# EAGLE design STM32F103_PCB (EAGLE 6.1)
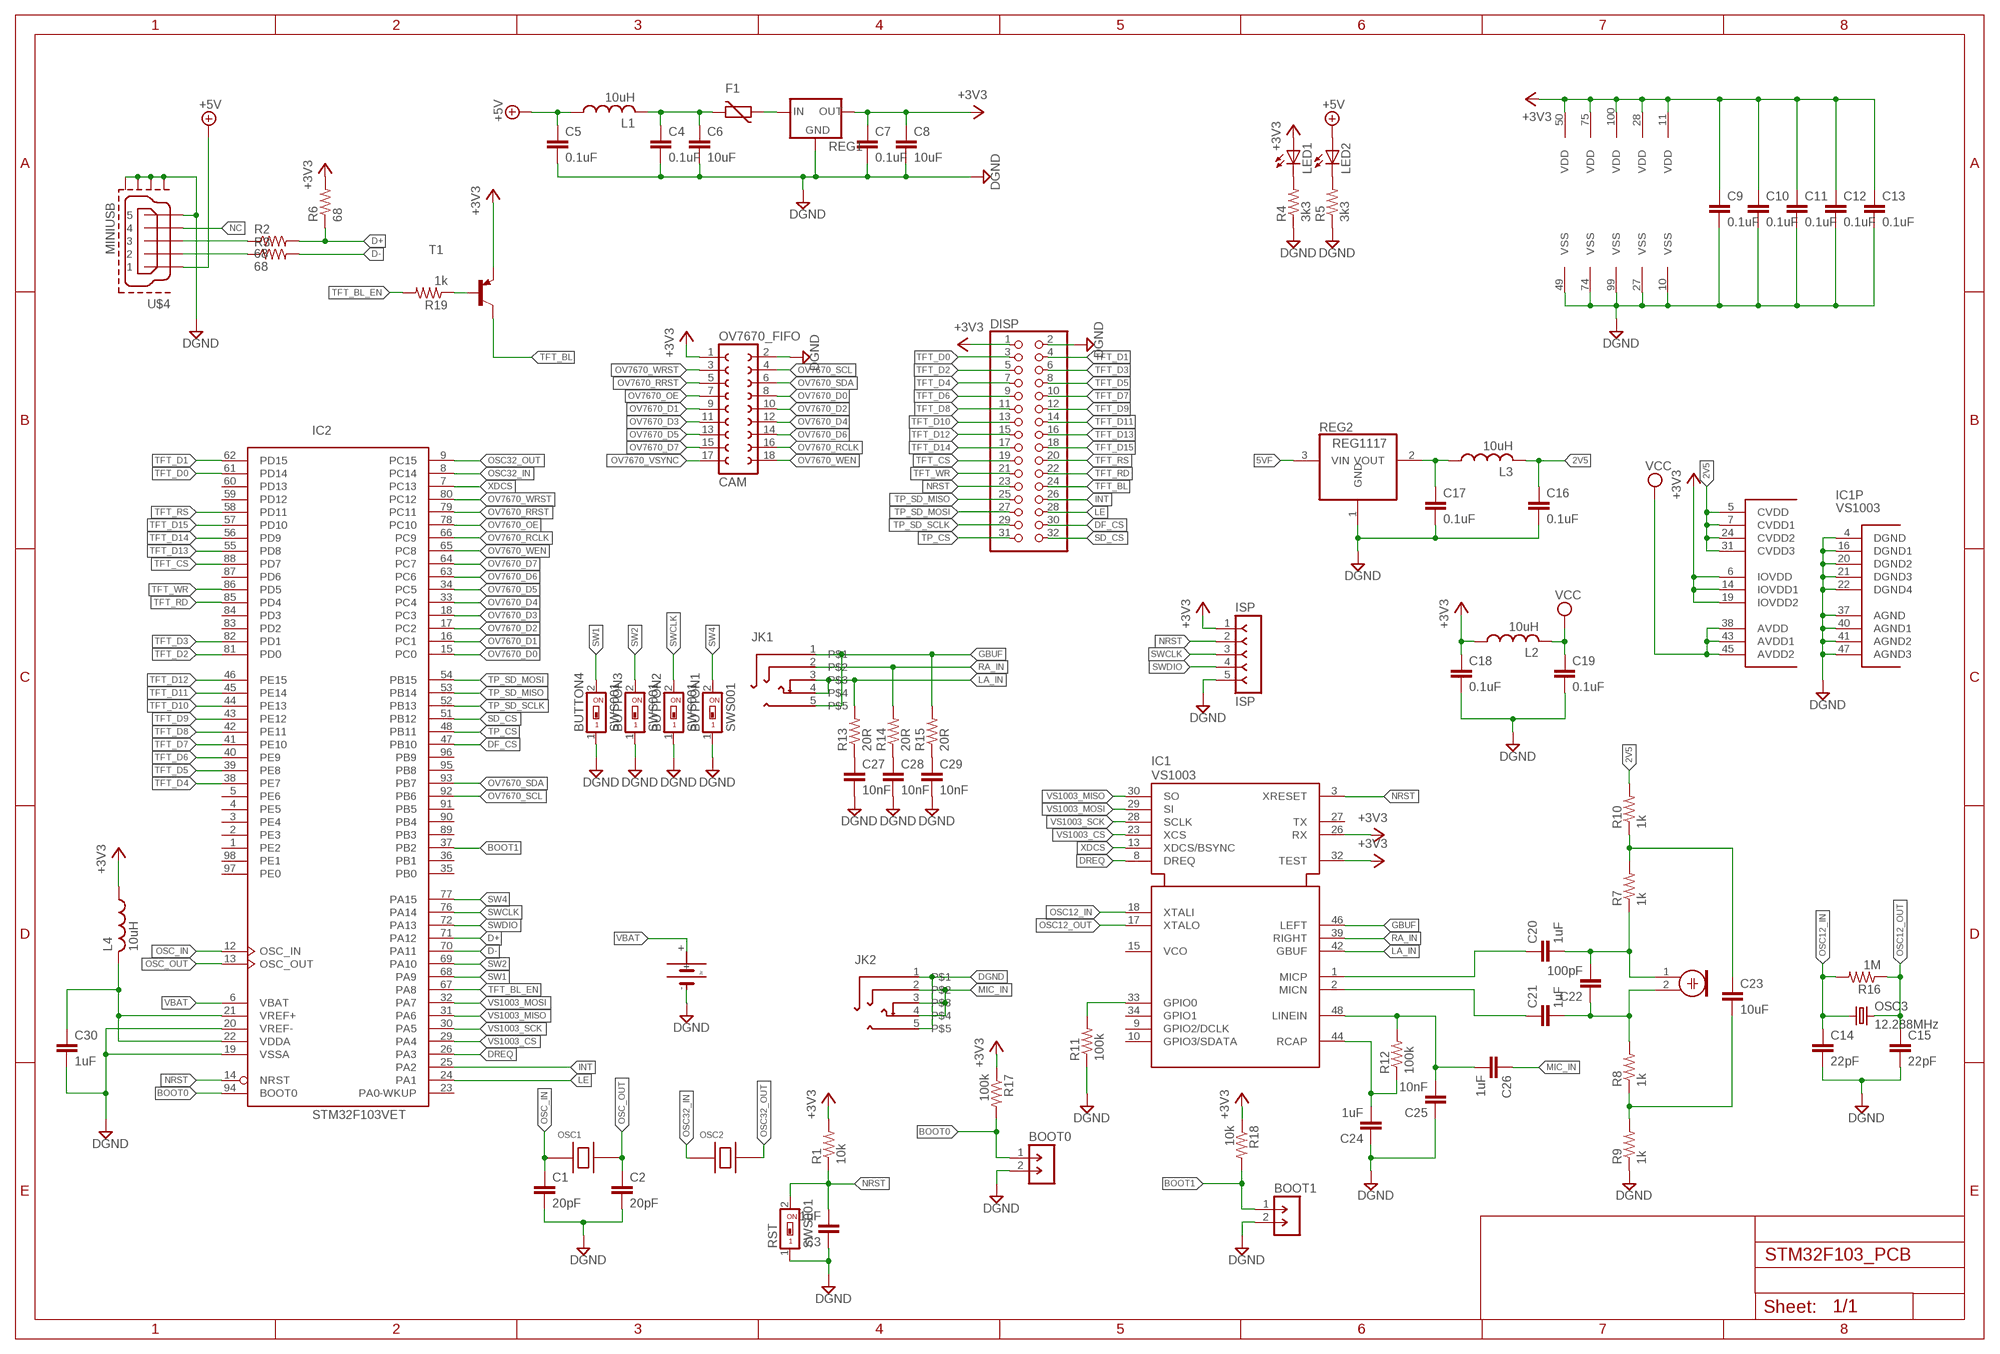
[diagram p0: schematic, sheet 1]

## Parts
BOOT0  M-1X02-SIP-100-32  [SIP-100-02-32]
BOOT1  M-1X02-SIP-100-32  [SIP-100-02-32]
BUTTON1  SWS001  [SMS-001]
BUTTON2  SWS001  [SMS-001]
BUTTON3  SWS001  [SMS-001]
BUTTON4  SWS001  [SMS-001]
C1  20pF  C-EUC1206  [C1206]
C2  20pF  C-EUC1206  [C1206]
C3  1uF  C-EUC1206  [C1206]
C4  0.1uF  C-EUC1206  [C1206]
C5  0.1uF  C-EUC1206  [C1206]
C6  10uF  C-EUC1206  [C1206]
C7  0.1uF  C-EUC1206  [C1206]
C8  10uF  C-EUC1206  [C1206]
C9  0.1uF  C-EUC1206  [C1206]
C10  0.1uF  C-EUC1206  [C1206]
C11  0.1uF  C-EUC1206  [C1206]
C12  0.1uF  C-EUC1206  [C1206]
C13  0.1uF  C-EUC1206  [C1206]
C14  22pF  C-EUC1206  [C1206]
C15  22pF  C-EUC1206  [C1206]
C16  0.1uF  C-EUC1206  [C1206]
C17  0.1uF  C-EUC1206  [C1206]
C18  0.1uF  C-EUC1206  [C1206]
C19  0.1uF  C-EUC1206  [C1206]
C20  1uF  C-EUC1206  [C1206]
C21  1uF  C-EUC1206  [C1206]
C22  100pF  C-EUC1206  [C1206]
C23  10uF  C-EUC1206  [C1206]
C24  1uF  C-EUC1206  [C1206]
C25  10nF  C-EUC1206  [C1206]
C26  1uF  C-EUC1206  [C1206]
C27  10nF  C-EUC1206  [C1206]
C28  10nF  C-EUC1206  [C1206]
C29  10nF  C-EUC1206  [C1206]
C30  1uF  C-EUC1206  [C1206]
CAM  OV7670_FIFO  FE09-2  [FE09-2]
DISP  PINHD-2X16  [2X16]
F1  VARISTORCN1206  [CT/CN1206]
IC1  VS1003  [LQFP48]
IC2  STM32F103VET  [LQFP100]
ISP  ISP  F-1X05-SIP-100-40  [SIP-100-05-40]
JK1  HEADPHONE_XXX1  [HEADPHONE_XXX1]
JK2  HEADPHONE_XXX1  [HEADPHONE_XXX1]
L1  10uH  L-USL3216C  [L3216C]
L2  10uH  L-USL3216C  [L3216C]
L3  10uH  L-USL3216C  [L3216C]
L4  10uH  L-USL3216C  [L3216C]
LED1  LEDSML1206  [SML1206]
LED2  LEDSML1206  [SML1206]
MIC  ELECTRET_MICROPHON-WM-61A  [WM-61A]
OSC1  8.0MHz  SMCE-7050  [IQG7050B]
OSC2  32.768kHz  SMAQ-5032A  [IQG5032A]
OSC3  12.288MHz  CRYSTALHC49UP  [HC49UP]
R1  10k  R-US_R1206  [R1206]
R2  68  R-US_R1206  [R1206]
R3  68  R-US_R1206  [R1206]
R4  3k3  R-US_R1206  [R1206]
R5  3k3  R-US_R1206  [R1206]
R6  68  R-US_R1206  [R1206]
R7  1k  R-US_R1206  [R1206]
R8  1k  R-US_R1206  [R1206]
R9  1k  R-US_R1206  [R1206]
R10  1k  R-US_R1206  [R1206]
R11  100k  R-US_R1206  [R1206]
R12  100k  R-US_R1206  [R1206]
R13  20R  R-US_R1206  [R1206]
R14  20R  R-US_R1206  [R1206]
R15  20R  R-US_R1206  [R1206]
R16  1M  R-US_R1206  [R1206]
R17  100k  R-US_R1206  [R1206]
R18  10k  R-US_R1206  [R1206]
R19  1k  R-US_R1206  [R1206]
REG1  XC63FPM  [SOT23]
REG2  REG1117  [SOT223]
RST  SWS001  [SMS-001]
T1  MMBT3906LT1-PNP-SOT23-BEC  [SOT23-BEC]
U$1  1220BATTERY_SF  [1220BATTERY]
U$4  MINIUSB  [MK5P]

## Nets
2V5: C16.1 IC1.5(CVDD) IC1.7(CVDD1) IC1.24(CVDD2) IC1.31(CVDD3) L3.2 R10.2
5VF: F1.1 REG1.3(IN) REG2.3(VIN)
+3V3: C7.1 C8.1 C9.1 C10.1 C11.1 C12.1 C13.1 C18.1 CAM.1 DISP.1 IC1.6(IOVDD) IC1.14(IOVDD1) IC1.19(IOVDD2) IC1.26(RX) IC1.32(TEST) IC2.11(VDD) IC2.28(VDD) IC2.50(VDD) IC2.75(VDD) IC2.100(VDD) ISP.1 L2.1 L4.1 LED1.A R1.2 R6.2 R17.1 R18.1 REG1.2(OUT) T1.E
+5V: C5.1 L1.1 LED2.A U$4.1
BOOT0: BOOT0.1 IC2.94(BOOT0) R17.2
BOOT1: BOOT1.1 IC2.37(PB2) R18.2
D+: IC2.71(PA12) R2.2 R6.1
D-: IC2.70(PA11) R3.2
DF_CS: DISP.30 IC2.47(PB10)
DGND: BOOT0.2 BOOT1.2 BUTTON1.1 BUTTON2.1 BUTTON3.1 BUTTON4.1 C1.2 C2.2 C3.1 C4.2 C5.2 C6.2 C7.2 C8.2 C9.2 C10.2 C11.2 C12.2 C13.2 C14.2 C15.2 C16.2 C17.2 C18.2 C19.2 C24.1 C25.1 C27.2 C28.2 C29.2 C30.2 CAM.2 DISP.2 IC1.4(DGND) IC1.16(DGND1) IC1.20(DGND2) IC1.21(DGND3) IC1.22(DGND4) IC1.37(AGND) IC1.40(AGND1) IC1.41(AGND2) IC1.47(AGND3) IC2.10(VSS) IC2.19(VSSA) IC2.20(VREF-) IC2.27(VSS) IC2.49(VSS) IC2.74(VSS) IC2.99(VSS) ISP.5 JK2.1 JK2.5 R4.1 R5.1 R9.1 R11.1 REG1.1(GND) REG2.1(GND) RST.1 U$1.- U$4.5 U$4.P$1(GND1) U$4.P$2(GND2) U$4.P$6(GND3) U$4.P$7(GND4)
DREQ: IC1.8(DREQ) IC2.26(PA3)
GBUF: IC1.46(LEFT) JK1.1 JK1.5 R15.2
INT: DISP.26 IC2.25(PA2)
LA_IN: IC1.42(GBUF) JK1.3 JK1.4 R13.2
LE: DISP.28 IC2.24(PA1)
MIC_IN: C26.1 JK2.2 JK2.3 JK2.4
N$1: C17.1 L3.1 REG2.2(VOUT)
N$2: R3.1 U$4.2
N$3: R2.1 U$4.3
N$4: C4.1 C6.1 F1.2 L1.2
N$5: LED1.C R4.2
N$6: LED2.C R5.2
N$7: C20.1 IC1.1(MICP)
N$8: C21.1 IC1.2(MICN)
N$9: C21.2 C22.1 MIC.2 R8.2
N$10: C20.2 C22.2 MIC.1 R7.1
N$11: C23.1 R7.2 R10.1
N$12: C23.2 R8.1 R9.2
N$13: IC1.33(GPIO0) R11.2
N$14: C24.2 IC1.44(RCAP) R12.1
N$15: C25.2 C26.2 IC1.48(LINEIN) R12.2
N$16: C27.1 R13.1
N$17: R19.1 T1.B
N$19: C28.1 R14.1
N$20: C29.1 R15.1
N$24: C30.1 IC2.21(VREF+) IC2.22(VDDA) L4.2
NC: U$4.4
NRST: C3.2 DISP.23 IC1.3(XRESET) IC2.14(NRST) ISP.2 R1.1 RST.2
OSC12_IN: C14.1 IC1.18(XTALI) OSC3.1 R16.2
OSC12_OUT: C15.1 IC1.17(XTALO) OSC3.2 R16.1
OSC32_IN: IC2.8(PC14) OSC2.P$1(PIN1)
OSC32_OUT: IC2.9(PC15) OSC2.P$2(PIN2)
OSC_IN: C1.1 IC2.12(OSC_IN) OSC1.P$1(PIN1)
OSC_OUT: C2.1 IC2.13(OSC_OUT) OSC1.P$3(PIN2)
OV7670_D0: CAM.8 IC2.15(PC0)
OV7670_D1: CAM.9 IC2.16(PC1)
OV7670_D2: CAM.10 IC2.17(PC2)
OV7670_D3: CAM.11 IC2.18(PC3)
OV7670_D4: CAM.12 IC2.33(PC4)
OV7670_D5: CAM.13 IC2.34(PC5)
OV7670_D6: CAM.14 IC2.63(PC6)
OV7670_D7: CAM.15 IC2.64(PC7)
OV7670_OE: CAM.7 IC2.78(PC10)
OV7670_RCLK: CAM.16 IC2.66(PC9)
OV7670_RRST: CAM.5 IC2.79(PC11)
OV7670_SCL: CAM.4 IC2.92(PB6)
OV7670_SDA: CAM.6 IC2.93(PB7)
OV7670_VSYNC: CAM.17
OV7670_WEN: CAM.18 IC2.65(PC8)
OV7670_WRST: CAM.3 IC2.80(PC12)
RA_IN: IC1.39(RIGHT) JK1.2 R14.2
SD_CS: DISP.32 IC2.51(PB12)
SW1: BUTTON4.2 IC2.68(PA9)
SW2: BUTTON3.2 IC2.69(PA10)
SW4: BUTTON1.2 IC2.77(PA15)
SWCLK: BUTTON2.2 IC2.76(PA14) ISP.3
SWDIO: IC2.72(PA13) ISP.4
TFT_BL: DISP.24 T1.C
TFT_BL_EN: IC2.67(PA8) R19.2
TFT_CS: DISP.19 IC2.88(PD7)
TFT_D0: DISP.3 IC2.61(PD14)
TFT_D1: DISP.4 IC2.62(PD15)
TFT_D2: DISP.5 IC2.81(PD0)
TFT_D3: DISP.6 IC2.82(PD1)
TFT_D4: DISP.7 IC2.38(PE7)
TFT_D5: DISP.8 IC2.39(PE8)
TFT_D6: DISP.9 IC2.40(PE9)
TFT_D7: DISP.10 IC2.41(PE10)
TFT_D8: DISP.11 IC2.42(PE11)
TFT_D9: DISP.12 IC2.43(PE12)
TFT_D10: DISP.13 IC2.44(PE13)
TFT_D11: DISP.14 IC2.45(PE14)
TFT_D12: DISP.15 IC2.46(PE15)
TFT_D13: DISP.16 IC2.55(PD8)
TFT_D14: DISP.17 IC2.56(PD9)
TFT_D15: DISP.18 IC2.57(PD10)
TFT_RD: DISP.22 IC2.85(PD4)
TFT_RS: DISP.20 IC2.58(PD11)
TFT_WR: DISP.21 IC2.86(PD5)
TP_CS: DISP.31 IC2.48(PB11)
TP_SD_MISO: DISP.25 IC2.53(PB14)
TP_SD_MOSI: DISP.27 IC2.54(PB15)
TP_SD_SCLK: DISP.29 IC2.52(PB13)
VBAT: IC2.6(VBAT) U$1.+
VCC: C19.1 IC1.38(AVDD) IC1.43(AVDD1) IC1.45(AVDD2) L2.2
VS1003_CS: IC1.23(XCS) IC2.29(PA4)
VS1003_MISO: IC1.30(SO) IC2.31(PA6)
VS1003_MOSI: IC1.29(SI) IC2.32(PA7)
VS1003_SCK: IC1.28(SCLK) IC2.30(PA5)
XDCS: IC1.13(XDCS/BSYNC) IC2.7(PC13)
Unconnected: IC1.9(GPIO2/DCLK) IC1.10(GPIO3/SDATA) IC1.15(VCO) IC1.27(TX) IC1.34(GPIO1) IC2.1(PE2) IC2.2(PE3) IC2.3(PE4) IC2.4(PE5) IC2.5(PE6) IC2.23(PA0-WKUP) IC2.35(PB0) IC2.36(PB1) IC2.59(PD12) IC2.60(PD13) IC2.83(PD2) IC2.84(PD3) IC2.87(PD6) IC2.89(PB3) IC2.90(PB4) IC2.91(PB5) IC2.95(PB8) IC2.96(PB9) IC2.97(PE0) IC2.98(PE1)

## Library data of the parts
BOOT0 BOOT1 = con-headers-jp:M-1X02-: MALE HEADER
BUTTON1-BUTTON4 RST = smd-special:SWS001: SMD Dip Switch 1 pol.
C1-C30 = resistor:C-EU: CAPACITOR, European symbol
CAM = con-lsta:FE09-2: FEMALE HEADER; OC_FARNELL: unknown; OC_NEWARK: unknown
DISP = pinhead:PINHD-2X16: PIN HEADER
F1 = varistor:VARISTOR: VARISTOR
IC1 = vlsi-web:VS1003: MP3 / WMA / MIDI Audio Codec Circuit
IC2 = micro-stm_v2:STM32F103V*T: ARM 32-bit Cortex™-M3 CPU 72 MHz maximum frequency 64 to 1028 Kbytes of Flash memory 20 to 96 kbytes of SRAM 80 GPIOs 2.0 to 3.6 V application supply
ISP = con-headers-jp:F-1X05-: FEMALE HEADER
JK1 JK2 = 2ref-packages-longpad:HEADPHONE_XXX1
L1-L4 = rcl:L-US: INDUCTOR, American symbol
LED1 LED2 = led:LED: LED OSRAM: - CHIPLED LG R971, LG N971, LY N971, LG Q971, LY Q971, LO R971, LY R971 LH N974, LH R974 LS Q976, LO Q976, LY Q976 LO Q996 - Hyper CHIPLED LW Q18S LB Q993, LB Q99A, LB R99A - SideLED LS A670, LO A670, LY A670, LG A670, LP A670 LB A673, LV A673, LT A673, LW A673 LH A674 LY A675 LS A676, LA A676, LO A676, LY A676, LW A676 LS A679, LY A679, LG A679 - Hyper Micro SIDELED® LS Y876, LA Y876, LO Y876, LY Y876 LT Y87S - SmartLED LW L88C, LW L88S LB L89C, LB L89S, LG L890 LS L89K, LO L89K, LY L89K LS L896, LA L896, LO L896, LY L896 - TOPLED LS T670, LO T670, LY T670, LG T670, LP T670 LSG T670, LSP T670, LSY T670, LOP T670, LYG T670 LG T671, LOG T671, LSG T671 LB T673, LV T673, LT T673, LW T673 LH T674 LS T676, LA T676, LO T676, LY T676, LB T676, LH T676, LSB T676, LW T676 LB T67C, LV T67C, LT T67C, LS T67K, LO T67K, LY T67K, LW E67C LS E67B, LA E67B, LO E67B, LY E67B, LB E67C, LV E67C, LT E67C LW T67C LS T679, LY T679, LG T679 LS T770, LO T770, LY T770, LG T770, LP T770 LB T773, LV T773, LT T773, LW T773 LH T774 LS E675, LA E675, LY E675, LS T675 LS T776, LA T776, LO T776, LY T776, LB T776 LHGB T686 LT T68C, LB T68C - Hyper Mini TOPLED® LB M676 - Mini TOPLED Santana® LG M470 LS M47K, LO M47K, LY M47K Source: http://www.osram.convergy.de LUXEON: - LUMILED® LXK2-PW12-R00, LXK2-PW12-S00, LXK2-PW14-U00, LXK2-PW14-V00 LXK2-PM12-R00, LXK2-PM12-S00, LXK2-PM14-U00 LXK2-PE12-Q00, LXK2-PE12-R00, LXK2-PE12-S00, LXK2-PE14-T00, LXK2-PE14-U00 LXK2-PB12-K00, LXK2-PB12-L00, LXK2-PB12-M00, LXK2-PB14-N00, LXK2-PB14-P00, LXK2-PB14-Q00 LXK2-PR12-L00, LXK2-PR12-M00, LXK2-PR14-Q00, LXK2-PR14-R00 LXK2-PD12-Q00, LXK2-PD12-R00, LXK2-PD12-S00 LXK2-PH12-R00, LXK2-PH12-S00 LXK2-PL12-P00, LXK2-PL12-Q00, LXK2-PL12-R00 Source: www.luxeon.com KINGBRIGHT: KA-3528ASYC Source: www.kingbright.com
MIC = microphon:ELECTRET_MICROPHON-: Electret Condenser Microphone
OSC1 = osc:SMCE-7050: Seam Welded Seal SMD Package SMCE-7050 4 Pads Pb-Free, RoHs Compliant Company Website:http://www.interquip.com/
OSC2 = osc:SMAQ-5032A: All Quartz SMD Package SMAQ-5032A 2Pads Pb-Free, RoHs Compliant Company Website:http://www.interquip.com/
OSC3 = crystal:CRYSTAL: CRYSTAL; OC_FARNELL: unknown; OC_NEWARK: unknown
R1-R19 = resistor:R-US_: RESISTOR, American symbol
REG1 = v-reg-3:XC63FP: Positiv Voltage Regulators www.torex.co.jp/english/product/pro02/pdf/0201_xc62fp.pdf
REG2 = burr-brown:REG1117: 800mA and 1A Low Dropout (LDO) Positive Regulator 1.8V, 2.5V, 2.85V, 3.3V, 5V, and Adj; MPN: REG1117; OC_FARNELL: 1097566; OC_NEWARK: 14P6981
T1 = transistor-neu-to92:*-PNP-: PNP Transistror
U$1 = battery2:1220BATTERY_SF
U$4 = usb_con-update:MINIUSB

## Board
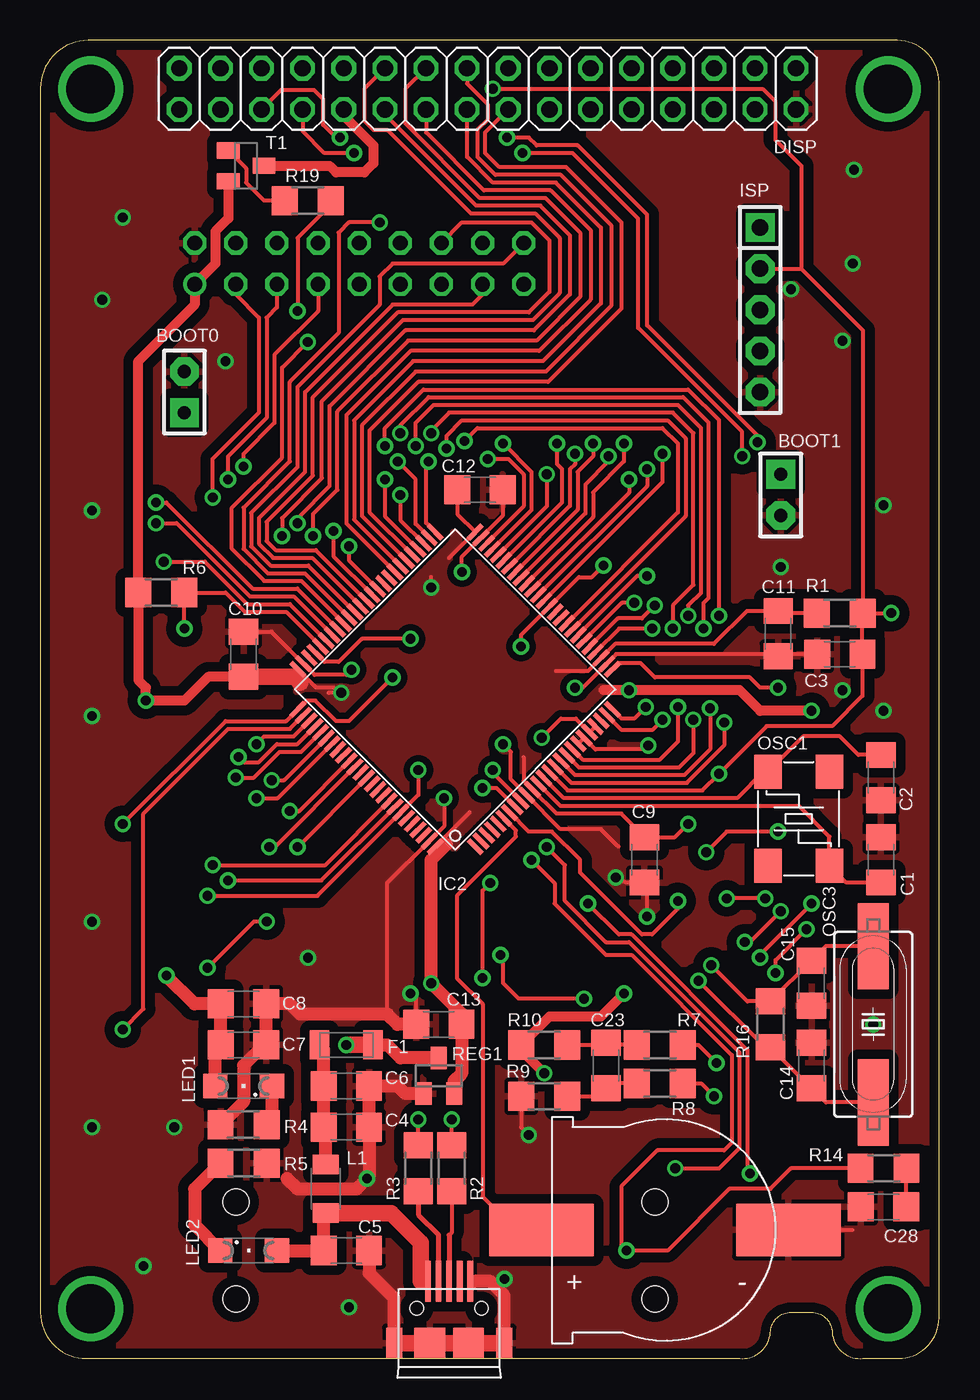
[diagram p1: board, top side]
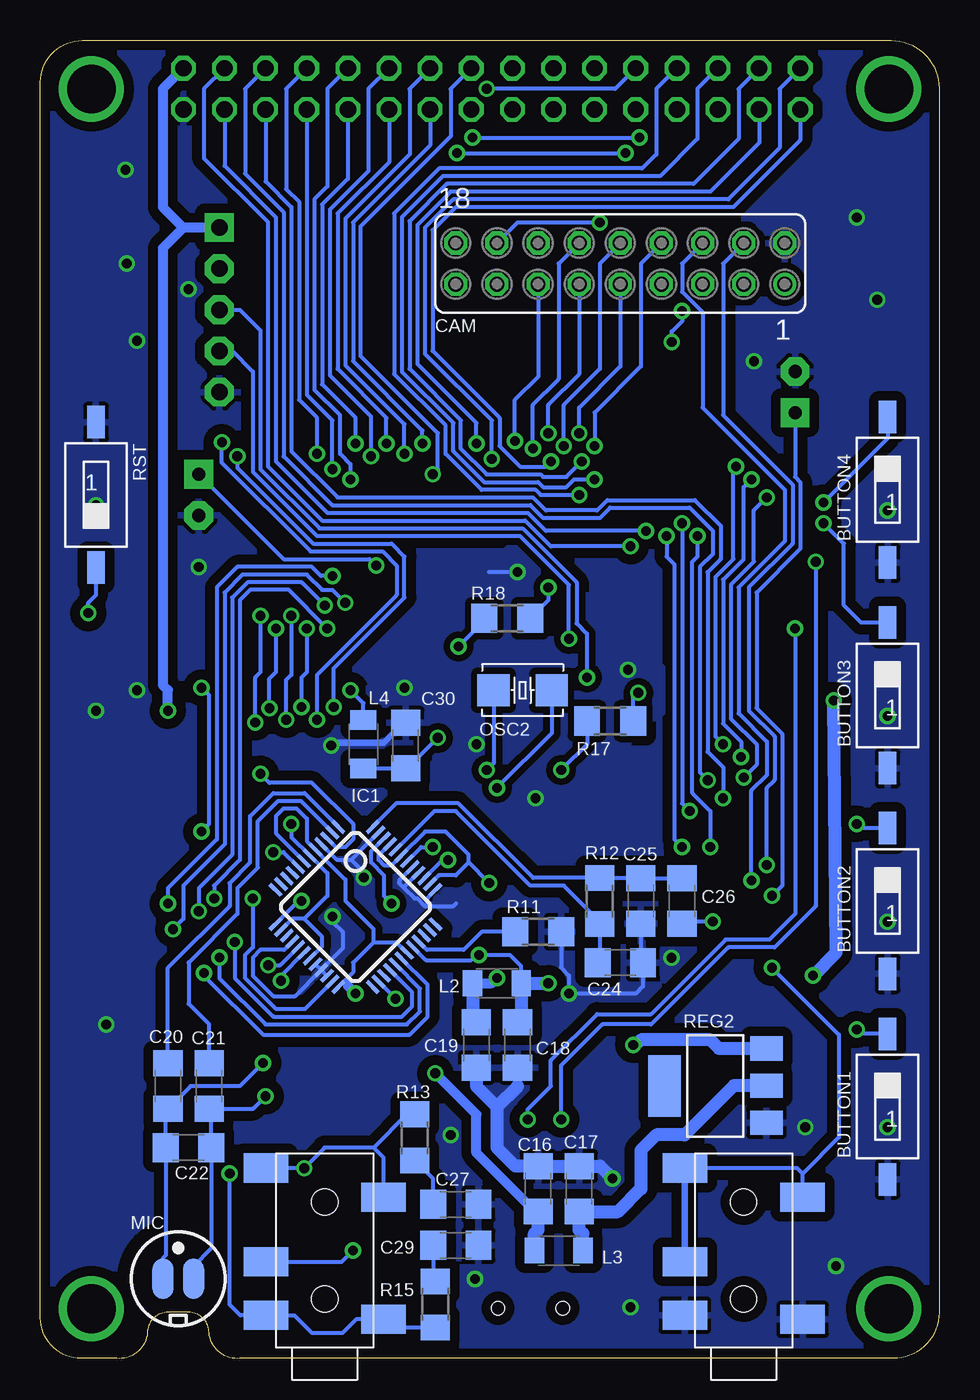
[diagram p2: board, bottom side, seen from below]

Size 55.5 x 81.41 mm. Coordinates in mm from the lower left corner, seen from the top.
Outline: 50.8,0.01 52.99,0.01 arc90 55.5,2.51 55.5,78.84 arc90 52.93,81.41 2.95,81.41 arc90 0,78.46 0,2.85 arc90 2.84,0.01 43.18,0.01 arc90 45.09,1.59 arc-90 46.35,2.86 47.62,2.86 arc-90 48.9,1.59 arc90 50.8,0.01
Copper layers (1*16): Top 0.035mm / dielectric 1.5mm / Bottom 0.035mm
Design rules: minimum track width 6mil, minimum drill 0.6mm, track to track 7mil, track to pad 7mil, pad to pad 7mil, via to via 7mil, smd to smd 7mil, copper to edge 15mil, drill to drill 10mil, minimum pad ring 10mil, minimum via ring 8mil, stop-mask expansion 4mil, vias tented up to drill 0.8mm, thermal gap 10mil

### Footprints (pad centres in the part's own frame; a part is rotated, then mirrored left to right if it is on the bottom)
SIP-100-02-32 = drill 0.813 pad 1.778 square: 1 -1.27,0 | drill 0.813 pad 1.778 octagon: 2 1.27,0
SMS-001 = smd 1.092 x 2.007: 1 0,-4.496; 2 0,4.496
C1206 = smd 1.6 x 1.8: 1 -1.4,0; 2 1.4,0
FE09-2 = drill 0.914: 1 -10.16,1.27 | drill 0.914 octagon: 2 -10.16,-1.27; 3 -7.62,1.27; 4 -7.62,-1.27; 5 -5.08,1.27; 6 -5.08,-1.27; 7 -2.54,1.27; 8 -2.54,-1.27; 9 0,1.27; 10 0,-1.27; 11 2.54,1.27; 12 2.54,-1.27; 13 5.08,1.27; 14 5.08,-1.27; 15 7.62,1.27; 16 7.62,-1.27; 17 10.16,1.27; 18 10.16,-1.27
2X16 = drill 1.016 octagon: 1 -19.05,-1.27; 2 -19.05,1.27; 3 -16.51,-1.27; 4 -16.51,1.27; 5 -13.97,-1.27; 6 -13.97,1.27; 7 -11.43,-1.27; 8 -11.43,1.27; 9 -8.89,-1.27; 10 -8.89,1.27; 11 -6.35,-1.27; 12 -6.35,1.27; 13 -3.81,-1.27; 14 -3.81,1.27; 15 -1.27,-1.27; 16 -1.27,1.27; 17 1.27,-1.27; 18 1.27,1.27; 19 3.81,-1.27; 20 3.81,1.27; 21 6.35,-1.27; 22 6.35,1.27; 23 8.89,-1.27; 24 8.89,1.27; 25 11.43,-1.27; 26 11.43,1.27; 27 13.97,-1.27; 28 13.97,1.27; 29 16.51,-1.27; 30 16.51,1.27; 31 19.05,-1.27; 32 19.05,1.27
CT/CN1206 = smd 1.2 x 1.8: 1 -1.65,0; 2 1.65,0
LQFP48 = smd 0.25 x 1: 1 -2.75,-4.25; 2 -2.25,-4.25; 3 -1.75,-4.25; 4 -1.25,-4.25; 5 -0.75,-4.25; 6 -0.25,-4.25; 7 0.25,-4.25; 8 0.75,-4.25; 9 1.25,-4.25; 10 1.75,-4.25; 11 2.25,-4.25; 12 2.75,-4.25; 25 2.75,4.25; 26 2.25,4.25; 27 1.75,4.25; 28 1.25,4.25; 29 0.75,4.25; 30 0.25,4.25; 31 -0.25,4.25; 32 -0.75,4.25; 33 -1.25,4.25; 34 -1.75,4.25; 35 -2.25,4.25; 36 -2.75,4.25 | smd 1 x 0.25: 13 4.25,-2.75; 14 4.25,-2.25; 15 4.25,-1.75; 16 4.25,-1.25; 17 4.25,-0.75; 18 4.25,-0.25; 19 4.25,0.25; 20 4.25,0.75; 21 4.25,1.25; 22 4.25,1.75; 23 4.25,2.25; 24 4.25,2.75; 37 -4.25,2.75; 38 -4.25,2.25; 39 -4.25,1.75; 40 -4.25,1.25; 41 -4.25,0.75; 42 -4.25,0.25; 43 -4.25,-0.25; 44 -4.25,-0.75; 45 -4.25,-1.25; 46 -4.25,-1.75; 47 -4.25,-2.25; 48 -4.25,-2.75
LQFP100 = smd 0.3 x 1.2: 1 -6,-7.75; 2 -5.5,-7.75; 3 -5,-7.75; 4 -4.5,-7.75; 5 -4,-7.75; 6 -3.5,-7.75; 7 -3,-7.75; 8 -2.5,-7.75; 9 -2,-7.75; 10 -1.5,-7.75; 11 -1,-7.75; 12 -0.5,-7.75; 13 0,-7.75; 14 0.5,-7.75; 15 1,-7.75; 16 1.5,-7.75; 17 2,-7.75; 18 2.5,-7.75; 19 3,-7.75; 20 3.5,-7.75; 21 4,-7.75; 22 4.5,-7.75; 23 5,-7.75; 24 5.5,-7.75; 25 6,-7.75; 51 6,7.75; 52 5.5,7.75; 53 5,7.75; 54 4.5,7.75; 55 4,7.75; 56 3.5,7.75; 57 3,7.75; 58 2.5,7.75; 59 2,7.75; 60 1.5,7.75; 61 1,7.75; 62 0.5,7.75; 63 0,7.75; 64 -0.5,7.75; 65 -1,7.75; 66 -1.5,7.75; 67 -2,7.75; 68 -2.5,7.75; 69 -3,7.75; 70 -3.5,7.75; 71 -4,7.75; 72 -4.5,7.75; 73 -5,7.75; 74 -5.5,7.75; 75 -6,7.75 | smd 1.2 x 0.3: 26 7.75,-6; 27 7.75,-5.5; 28 7.75,-5; 29 7.75,-4.5; 30 7.75,-4; 31 7.75,-3.5; 32 7.75,-3; 33 7.75,-2.5; 34 7.75,-2; 35 7.75,-1.5; 36 7.75,-1; 37 7.75,-0.5; 38 7.75,0; 39 7.75,0.5; 40 7.75,1; 41 7.75,1.5; 42 7.75,2; 43 7.75,2.5; 44 7.75,3; 45 7.75,3.5; 46 7.75,4; 47 7.75,4.5; 48 7.75,5; 49 7.75,5.5; 50 7.75,6; 76 -7.75,6; 77 -7.75,5.5; 78 -7.75,5; 79 -7.75,4.5; 80 -7.75,4; 81 -7.75,3.5; 82 -7.75,3; 83 -7.75,2.5; 84 -7.75,2; 85 -7.75,1.5; 86 -7.75,1; 87 -7.75,0.5; 88 -7.75,0; 89 -7.75,-0.5; 90 -7.75,-1; 91 -7.75,-1.5; 92 -7.75,-2; 93 -7.75,-2.5; 94 -7.75,-3; 95 -7.75,-3.5; 96 -7.75,-4; 97 -7.75,-4.5; 98 -7.75,-5; 99 -7.75,-5.5; 100 -7.75,-6
SIP-100-05-40 = drill 1.016 pad 1.778 square: 1 -5.08,0 | drill 1.016 pad 1.778 octagon: 2 -2.54,0; 3 0,0; 4 2.54,0; 5 5.08,0
HEADPHONE_XXX1 = smd 2.75 x 1.8: 1 -3.635,4.25; 2 3.635,0.7; 3 -3.635,-3.3; 4 3.635,-5.1; 5 3.635,4 | hole 1.6: 0,3; 0,-3
L3216C = smd 1.2 x 1.6: 1 -1.5,0; 2 1.5,0
SML1206 = smd 1.5 x 1.5: A 1.75,0; C -1.75,0
WM-61A = smd 2.5 x 1.3: 1 0,0.95; 2 0,-0.95
IQG7050B = smd 2.1 x 1.7: P$1 -2.9,-1.9; P$2 2.9,-1.9; P$3 2.9,1.9; P$4 -2.9,1.9
IQG5032A = smd 2 x 2: P$1 -1.8,0; P$2 1.8,0
HC49UP = smd 5.334 x 1.93: 1 -4.826,0; 2 4.826,0
R1206 = smd 1.6 x 1.803: 1 -1.422,0; 2 1.422,0
SOT23 = smd 1 x 1.4: 1 -0.95,-1.1; 2 0.95,-1.1; 3 0,1.1
SOT223 = smd 1.499 x 2.007: 1 -2.261,-3.15; 2 0.025,-3.15; 3 2.311,-3.15 | smd 3.81 x 2.007: 4 0,3.15
SOT23-BEC = smd 1 x 1.4: B -0.95,-1.1; C 0,1.1; E 0.95,-1.1
1220BATTERY = smd 6.452 x 3.251: + -6.985,0; - 8.255,0
MK5P = smd 0.35 x 2.54: 1 -1.3,3.81; 2 -0.65,3.81; 3 0,3.81; 4 0.65,3.81; 5 1.3,3.81 | smd 1.9 x 1.9: P$1 1.2,0; P$2 -1.2,0 | smd 1 x 1.9: P$6 -3.4,0; P$7 3.4,0 | hole 0.8: 2,2.15; -2,2.15

### Placement (x,y rotation side)
BOOT0  8.89,59.7 90 top
BOOT1  45.72,53.35 270 top
BUTTON1  3.17,15.56 0 bottom
BUTTON2  3.17,28.26 0 bottom
BUTTON3  3.17,40.96 0 bottom
BUTTON4  3.17,53.66 0 bottom
C1  51.91,30.8 90 top
C2  51.91,35.88 270 top
C3  49.37,43.5 0 top
C4  18.89,14.29 0 top
C5  18.89,6.67 0 top
C6  18.89,16.83 0 top
C7  12.54,19.37 0 top
C8  12.54,21.91 0 top
C9  37.31,30.8 270 top
C10  12.54,43.5 90 top
C11  45.56,44.77 270 top
C12  27.15,53.66 0 top
C13  24.61,20.64 180 top
C14  47.62,18.1 90 top
C15  47.62,23.18 270 top
C16  24.77,10.48 90 bottom
C17  22.23,10.48 90 bottom
C18  26.04,19.37 270 bottom
C19  28.57,19.37 270 bottom
C20  47.62,16.83 270 bottom
C21  45.09,16.83 270 bottom
C22  46.35,13.02 180 bottom
C23  34.92,18.1 270 top
C24  19.68,24.45 180 bottom
C25  18.41,28.26 90 bottom
C26  15.88,28.26 90 bottom
C27  29.84,9.53 0 bottom
C28  52.07,9.37 180 top
C29  29.84,6.99 0 bottom
C30  32.94,37.87 90 bottom
CAM  19.68,67.63 180 bottom
DISP  27.62,78.43 180 top
F1  18.89,19.37 180 top
IC1  36.04,27.89 225 bottom
IC2  25.61,41.34 45 top
ISP  44.45,64.78 270 top
JK1  37.94,6.67 180 bottom
JK2  12.06,6.67 180 bottom
L1  17.62,10.48 90 top
L2  27.3,23.18 180 bottom
L3  23.5,6.67 180 bottom
L4  35.56,37.95 270 bottom
LED1  12.54,16.83 180 top
LED2  12.86,6.67 0 top
MIC  46.99,4.93 90 bottom
OSC1  46.83,33.34 90 top
OSC2  25.72,41.28 180 bottom
OSC3  51.44,20.64 90 top
R1  49.37,46.04 180 top
R2  25.4,11.75 90 top
R3  23.34,11.75 90 top
R4  12.54,14.45 0 top
R5  12.54,12.07 180 top
R6  7.46,47.31 180 top
R7  38.26,19.37 180 top
R8  38.26,16.99 0 top
R9  31.11,16.2 0 top
R10  31.11,19.37 180 top
R11  24.77,26.36 180 bottom
R12  20.95,28.26 90 bottom
R13  32.38,13.66 90 bottom
R14  52.07,11.75 180 top
R15  31.11,3.34 270 bottom
R16  45.09,20.64 270 top
R17  20.32,39.38 180 bottom
R18  26.67,45.73 180 bottom
R19  16.51,71.52 0 top
REG1  24.61,17.47 0 top
REG2  13.81,16.83 90 bottom
RST  52.07,53.35 180 bottom
T1  12.7,73.67 270 top
U$1  37.94,7.94 0 top
U$4  25.24,0.96 0 top

### Tracks (layer width: path | path; a pad name or v marks a point on that pad's centre or on a via)
2V5  (via drill 0.6)
  Top 0.61: v36.04,22.55 34.61,21.12 31.44,21.12 R10.2 29.69,19.05 v31.11,17.63
  Bottom 0.254: IC1.7 40.96,32.46 40.96,33.5 40.48,33.98 39.69,33.98 39.05,33.34 39.05,31.97 IC1.5 36.67,29.58 36.67,28.27 34.92,26.52 34.92,25.73 | 36.53,23.52 IC1.24 | 36.51,23.03 36.53,23.52 | 34.92,25.73 33.52,25.73 IC1.31 | 34.92,25.73 36.2,24.46 36.2,23.85 36.53,23.52
  Bottom 0.61: 36.51,23.03 v36.04,22.55 | C16.1 24.95,9.09 28.57,12.71 28.57,15.09 v31.11,17.63
  Bottom 0.813: L3.2 25,7.71 24.77,7.95 C16.1
5VF  (via drill 0.6)
  Top 0.813: F1.1 21.43,19.37 22.24,18.57 REG1.3
  Top 1.016: F1.1 v18.89,19.37
  Bottom 0.813: v18.89,19.37 18.73,19.37 18.41,19.69 14.13,19.69 13.58,19.15 REG2.3
+3V3  (via drill 0.6)
  Top 0.254: C12.1 25.75,52.16 IC2.50 25.24,49.45 | 26.51,33.75 IC2.100 24.75,31.93 25.08,31.76 | 31.83,42.47 33.82,42.47 IC2.28 35.49,44.14 41.59,44.14 43.63,46.17 C11.1 45.69,46.05 R1.2 | 18.1,41.44 17.02,41.44 IC2.75 15.89,41.9 15.95,41.84 | v40.01,33.03 39.18,32.2 C9.1 37.31,32.23 35.88,33.66 31.87,33.66 IC2.11 29.84,35.69 29.84,37.16 | v28.42,24.93 28.57,24.77 28.57,23.18 29.53,22.23 v33.56,22.23 | v18.57,41.12 17.78,41.12 | v24.13,47.63 24.13,48.27
  Top 0.61: v47.62,40.01 44.45,40.01 43.18,41.28 v36.35,41.28 34.77,41.28 | C10.1 10.35,42.1 8.89,40.65 v6.51,40.65 6.51,41.44 6.04,41.91 R6.2 6.04,61.61 9.53,65.1 CAM.1 10.79,67.63 10.79,69.62 11.6,70.42 T1.E
  Top 0.813: LED1.A 10.79,19.02 C7.1 C8.1 9.53,21.91 v7.78,23.66 | 25.08,31.76 24.13,30.8 v24.13,23.18 26.01,21.31 C13.1 26.01,17.6 25.56,17.15 REG1.2
  Top 1.016: C10.1 15.69,42.1 15.95,41.84 16.03,41.76
  Bottom 0.254: v40.01,33.03 40.01,32.21 IC1.6 37.78,29.99 37.78,28.58 39.21,27.15 | IC1.32 31.7,24.61 28.89,24.61 v28.42,24.93 26.51,24.93 25.8,24.23 L2.1 | v33.56,22.23 IC1.26 | IC1.19 38.1,25.48 38.1,26.04 39.21,27.15 | 39.21,27.15 39.96,27.15 IC1.14 | R17.1 18.9,40.8 v18.57,41.12 | 25.25,45.88 R18.1 24.13,46.85 v24.13,47.63 | L4.1 35.56,40.49 v36.35,41.28
  Bottom 0.61: DISP.1 47.94,78.43 47.94,71.13 46.67,69.86 | v47.62,40.01 47.62,41.28 47.94,41.6 47.94,68.59 46.67,69.86 | ISP.1 46.67,69.86
  Bottom 0.813: C18.1 25.8,21 L2.1 v24.13,23.18 | v7.78,23.66 6.35,25.09 v6.51,40.65
  pour Top (isolate 0.406): 15.72,41.28 25.56,51.12 35.4,41.28 25.56,31.44
+5V
  Top 0.305: U$4.1 23.5,4.77
  Top 0.813: L1.1 17.49,8.86 C5.1 LED2.A
  Top 1.016: L1.1 21.66,8.98 23.5,7.15 23.5,4.77
BOOT0  (via drill 0.6)
  Top 0.254: v23.34,36.36 23.34,34.82 IC2.94 17.1,28.58 v10.32,28.58
  Bottom 0.254: R17.2 21.74,37.96 v23.34,36.36 | BOOT0.1 8.89,54.46 8.57,54.14 8.57,50.01 11.27,47.31 11.27,40.17 9.68,38.58 9.68,29.22 v10.32,28.58
BOOT1  (via drill 0.6)
  Top 0.254: v29.69,43.98 29.69,44.7 IC2.37 33.25,48.27 34.05,48.27 v34.77,48.98
  Bottom 0.254: R18.2 28.09,45.58 v29.69,43.98 | BOOT1.1 40.48,49.38 35.16,49.38 v34.77,48.98
D+  (via drill 0.6)
  Top 0.254: R2.2 v25.4,14.77 | R6.1 11.44,47.31 12.62,46.12 15.17,46.12 IC2.71 | v8.89,45.09 R6.1 | R6.1
  Bottom 0.254: v25.4,14.77 25.4,15.41 23.97,16.84 23.97,18.42 21.11,21.28 17.78,21.28 13.18,25.88 10.48,25.88 8.89,27.47 v8.89,45.09
D-  (via drill 0.6)
  Top 0.254: R3.2 v23.34,14.77 | v7.62,49.22 10.16,49.22 12.78,46.6 15.4,46.6 IC2.70
  Bottom 0.254: v23.34,14.77 23.34,18.11 20.8,20.64 17.78,20.64 13.02,25.41 10.16,25.41 7.62,27.95 v7.62,49.22
DF_CS  (via drill 0.6)
  Top 0.254: IC2.47 30.32,52.41 30.32,54.78 v28.57,56.52
  Bottom 0.254: DISP.30 11.11,75.1 14.13,72.08 30.16,72.08 32.23,70.02 32.23,61.44 28.57,57.79 v28.57,56.52
DGND  (via drill 0.6)
  Top 0.254: 21.43,21.28 21.43,29.38 IC2.99 24.92,32.87 v24.92,34.62 | C12.2 28.55,52.05 IC2.49 26.04,49.54 v26.04,48.59 | v19.21,42.55 18.89,42.23 16.94,42.23 IC2.74 14.27,44.91 C10.2 | C3.1 45.69,43.51 C11.2 45.56,43.51 35.56,43.51 IC2.27 33.5,41.44 v33.02,41.44 | v37.47,27.31 37.47,29.25 C9.2 36.17,29.41 v35.53,29.72 | 23.18,22.23 v22.86,22.55 23.21,22.2 C13.2 | U$1.- 50.16,7.95 | 35.69,31.63 34.61,32.71 32.12,32.71 IC2.10 29.05,35.78 29.05,37.47 v28.57,37.95 | R9.1 29.69,14.29 v30.16,13.82 | IC2.19 IC2.20 34.27,37.63 37.31,37.63 v37.54,37.87
  Top 0.305: U$4.5 26.83,4.77
  Top 0.813: C5.2 20.29,5.28 21.84,3.72 U$4.P$6 | R4.1 12.54,15.88 12.54,18.11 13.81,19.37 C7.2 C8.2 15.4,21.91 16.03,21.28 21.43,21.28 22.07,20.64 C13.2 | U$4.P$7 28.64,3.91 27.78,4.77 26.83,4.77 | REG1.1 22.53,16.37 22.07,16.84 C6.2 C4.2 20.29,11.25 v20.16,11.12 19.53,10.48 15.88,10.48 15.24,11.12
  Top 1.016: U$4.P$6 U$4.P$2 U$4.P$1 U$4.P$7
  Bottom 0.254: v26.04,48.59 27.78,48.59 | v37.47,27.31 37.47,27 36.83,26.36 36.83,25.34 IC1.21 | IC1.22 IC1.21 | IC1.37 31.62,28.42 31.62,28.08 31.75,27.95 | IC1.41 33.31,29.56 33.37,29.41 33.02,29.06 | 33.02,29.06 33.02,29.15 IC1.40 | 33.02,29.06 | 33.02,29.06 32.38,28.42 32.23,28.42 31.75,27.95 | IC1.4 37.19,30.8 36.31,30.8 | R11.1 23.34,24.14 22.86,23.66 v22.86,22.55 18.73,22.55 18.29,23 C24.1 18.41,24.59 C25.1 | 36.31,30.8 IC1.47 | v35.53,29.72 35.69,30.18 36.31,30.8 | v30.16,13.82 30.16,13.5 | IC1.21 39.77,22.39 41.12,22.39 42.39,23.66 42.39,24.77 41.91,25.25 40.45,25.25 IC1.16 | IC1.20 IC1.21 | 31.75,27.95 30,27.95 29.84,28.11
  Bottom 0.406: C30.2 33.05,39.27 34.29,38.03 37.39,38.03 v37.54,37.87
  Bottom 0.813: 20.48,11.44 v20.16,11.12 20.93,11.88 C17.2 C16.2 26.16,11.88 27.3,13.03 27.3,15.56 | 26.04,16.84 27.3,15.56 | C19.2 28.57,16.84 27.3,15.56
  other vias: 8.26,14.29 45.72,48.9 51.44,20.64 3.18,14.29 3.18,26.99 3.18,39.69 3.18,52.39 46.35,66.05 50.16,67.63 52.07,52.71 49.53,62.87 52.07,40.01 49.53,41.28 16.52,24.77 5.09,70.49 3.82,65.41 11.44,61.6 19.06,3.18 28.66,4.92 6.36,5.72 50.24,73.43
  pour Bottom (isolate 0.406): 15.72,41.28 25.56,51.12 35.4,41.28 25.56,31.44
  pour Bottom (isolate 0.406): 35.88,32.39 31.75,27.95 34.92,24.45 35.88,23.5 40.32,27.95
  pour Top (isolate 0.61, rank 2): -0.64,0.32 -0.64,84.14 53.98,84.14 56.52,81.6 56.52,-0.95 0.64,-0.95
  pour Bottom (isolate 0.61, rank 2): -0.64,0.32 -0.64,84.14 56.52,84.14 56.52,-0.95 0.64,-0.95
DREQ  (via drill 0.6)
  Top 0.254: v45.56,32.55 42.39,32.55 v41.12,31.28 | v45.56,41.44 44.45,41.44 43.81,42.08 37.94,42.08 37.07,42.95 35.71,42.95 IC2.26
  Bottom 0.254: v45.56,32.55 45.09,33.03 45.09,40.97 v45.56,41.44 | v41.12,31.28 40.49,31.28 IC1.8
GBUF  (via drill 0.6)
  Top 0.254: v33.81,28.11 35.72,26.2 36.51,26.2 43.66,19.06 43.66,11.6 v43.81,11.44
  Bottom 0.254: R15.2 33.8,1.92 JK1.1 36,2.42 36.83,1.59 38.73,1.59 39.81,2.67 JK1.5 43.15,2.67 43.81,3.34 v43.81,11.44 | IC1.46 35.08,31.33 35.08,30.65 34.29,29.85 34.29,28.58 v33.81,28.11 33.97,28.27
INT  (via drill 0.6)
  Top 0.254: v37.39,40.25 36.67,39.54 35.9,39.54 IC2.25 | v43.34,55.73 43.34,57.24 36.91,63.67 36.91,70.41 32.86,74.46 v29.77,74.46 | v19.37,74.46 17.54,74.46 16.19,75.81 DISP.26
  Bottom 0.254: v37.39,40.25 37.39,42.63 33.02,47 33.02,49.54 33.81,50.33 38.66,50.33 43.34,55.01 v43.34,55.73 | v29.77,74.46 v19.37,74.46
LA_IN  (via drill 0.6)
  Top 0.254: v39.21,11.76 41.91,11.76 43.18,13.03 43.18,18.9 36.35,25.73 34.92,25.73 32.38,28.27 32.38,30.49 v31.27,31.6
  Bottom 0.254: IC1.42 31.98,31.6 v31.27,31.6 | JK1.3 34.31,12.41 34.92,13.03 | JK1.4 39.23,11.78 v39.21,11.76 37.94,13.03 34.92,13.03 | R13.2 32.87,15.08 34.92,13.03
LE  (via drill 0.6)
  Top 0.254: v38.42,39.46 37.78,38.82 35.91,38.82 IC2.24 | v44.29,56.6 44.29,57 37.47,63.83 37.47,70.65 33.18,74.94 30.64,74.94 30.16,75.41 v28.81,75.41 | DISP.28 14.84,78.35 16.91,78.35 17.46,77.79 17.46,76.21 18.26,75.41 v18.49,75.41
  Bottom 0.254: v38.42,39.46 38.42,42.23 33.5,47.16 33.5,48.98 34.37,49.85 38.81,49.85 44.29,55.33 v44.29,56.6 | v28.81,75.41 v18.49,75.41
MIC_IN  (via drill 0.6)
  Top 0.254: v13.97,27 13.18,27 v10.32,24.14
  Bottom 0.254: v13.97,27 15.74,27 C26.1 | JK2.4 8.78,11.78 8.43,11.42 | v10.32,24.14 6.19,20.01 6.19,13.66 8.43,11.42 | JK2.3 8.43,11.42
  Bottom 0.406: JK2.2 JK2.4
N$1
  Bottom 0.813: L3.1 22,7.71 22.23,7.95 C17.1 19.82,9.09 18.41,10.48 18.41,12.87 17.46,13.82 15.72,13.82 12.68,16.86 REG2.2
N$2
  Top 0.305: U$4.2 24.59,7.64 23.34,8.9 R3.1
N$3
  Top 0.254: R2.1 25.4,7.79 25.24,7.63
  Top 0.305: 25.24,7.63 U$4.3
N$4
  Top 0.813: L1.2 17.62,14.17 C4.1 C6.1 17.49,19.12 F1.2
N$5
  Top 0.813: LED1.C 14.29,14.62 R4.2
N$6
  Top 0.813: R5.2 9.53,10.48 9.53,8.26 LED2.C
N$7
  Bottom 0.254: 37.12,32.84 IC1.1 39.19,34.93 41.12,34.93 42.55,33.5 42.55,30.65 43.81,29.38 43.81,27.95 47.62,24.14 C20.1
N$8
  Bottom 0.254: IC1.2 39.42,34.46 40.8,34.46 42.07,33.19 42.07,30.33 43.34,29.06 43.34,27.47 46.35,24.46 46.35,21.91 45.09,20.64 C21.1
N$9  (via drill 0.6)
  Top 0.254: R8.2 40.8,16.99 v41.59,16.2
  Bottom 0.254: v41.59,16.2 42.36,15.44 C21.2 44.95,15.3 C22.1 44.95,6.81 46.04,5.72 MIC.2
N$10  (via drill 0.6)
  Top 0.254: R7.1 40.64,19.37 v41.75,18.26
  Bottom 0.254: v41.75,18.26 43.18,16.84 46.23,16.84 C20.2 47.76,15.3 C22.2 47.76,6.39 47.94,6.2 MIC.1
N$11
  Top 0.254: R10.1 34.8,19.37 C23.1 35.05,19.37 R7.2
N$12
  Top 0.254: R8.1 35.21,16.99 C23.2 34.42,16.2 R9.2
N$13
  Bottom 0.254: IC1.33 31.63,25.25 29.37,25.25 28.26,26.36 R11.2
N$14
  Bottom 0.254: C24.2 20.95,24.59 R12.1 20.95,27 23.18,29.22 25.24,29.22 29.84,33.82 31.17,33.82 IC1.44
N$15
  Bottom 0.254: IC1.48 33.53,34.3 29.69,34.3 25.08,29.69 R12.2 18.44,29.69 C25.2 C26.2
N$16
  Bottom 0.254: C27.1 31.25,11.1 R13.1
N$17
  Top 0.254: T1.B 12.7,73.51 12.7,72.64 13.82,71.52 R19.1
N$18  (via drill 3)
  other vias: 52.35,3.08
N$19
  Top 0.254: C28.1 53.47,11.73 R14.1
N$20
  Bottom 0.254: C29.1 31.25,4.89 R15.1
N$21  (via drill 3)
  other vias: 3.1,78.42
N$22  (via drill 3)
  other vias: 3.1,3.08
N$24  (via drill 0.6)
  Top 0.254: IC2.22 IC2.21 33.07,39.54 32.15,39.54 v30.96,38.35
  Bottom 0.254: L4.2 32.96,36.45 C30.1 32.83,36.47 v30.96,38.35
NRST  (via drill 0.6)
  Top 0.254: IC2.14 32.57,35.09 40.88,35.09 v41.91,36.12 44.85,39.06 48.9,39.06 50.77,40.94 C3.2 50.77,46.02 R1.1 | v27.94,78.43 44.61,78.43 45.4,77.64 45.4,75.26 46.99,73.67 46.99,67.32 | R1.1 v52.55,46.05 | ISP.2 46.99,67.32 | 46.99,67.32 50.8,63.51 R1.1
  Bottom 0.254: IC1.3 37.27,31.6 36.67,31.6 36.2,32.08 36.2,33.03 38.73,35.57 41.35,35.57 v41.91,36.12 | DISP.23 20,78.43 v27.94,78.43 | v52.55,46.05 52.55,46.68 52.07,47.16 RST.2
OSC12_IN  (via drill 0.6)
  Top 0.254: v40.64,23.34 44.76,19.22 R16.2 47.6,16.71 C14.1 48.51,15.82 OSC3.1
  Bottom 0.254: v40.64,23.34 40.64,23.65 IC1.18
OSC12_OUT  (via drill 0.6)
  Top 0.254: 41.53,24.2 v41.43,24.3 43.66,22.07 R16.1 47.6,24.59 C15.1 48.51,25.47 OSC3.2
  Bottom 0.254: v41.43,24.3 40.7,24.3 IC1.17
OSC32_IN  (via drill 0.6)
  Top 0.254: v27.3,35.25 28.16,35.25 IC2.8
  Bottom 0.254: OSC2.P$1 23.92,38.64 v27.3,35.25
OSC32_OUT  (via drill 0.6)
  Top 0.254: v27.94,36.36 27.94,36.18 IC2.9
  Bottom 0.254: OSC2.P$2 27.52,36.78 v27.94,36.36
OSC_IN
  Top 0.254: IC2.12 32.1,34.14 46.83,34.14 48.73,32.24 OSC1.P$1 49.77,29.41 C1.1
OSC_OUT
  Top 0.254: C2.1 50.51,37.29 49.37,38.42 47.11,38.42 OSC1.P$3 44.65,36.24 43.02,34.62 32.34,34.62 IC2.13
OV7670_D0  (via drill 0.6)
  Top 0.254: v21.27,56.36 21.27,57.48 23.65,59.86 40.01,59.86 41.91,57.95 v41.91,45.89 | IC2.15 32.8,35.57 39.93,35.57 42.23,37.87 v42.23,39.3
  Bottom 0.254: CAM.8 18.41,67.63 18.41,61.29 21.27,58.43 v21.27,56.36 | v41.91,45.89 41.91,42.39 42.23,42.08 v42.23,39.3
OV7670_D1  (via drill 0.6)
  Top 0.254: IC2.16 33.03,36.04 39.77,36.04 41.35,37.63 v41.35,40.17 | v22.23,57.16 22.23,57.63 23.97,59.38 39.69,59.38 41.27,57.79 41.27,47 40.96,46.68 v40.96,45.09
  Bottom 0.254: CAM.9 19.68,61.29 22.23,58.74 v22.23,57.16 | v40.96,45.09 40.96,42.39 41.35,42 v41.35,40.17
OV7670_D2  (via drill 0.6)
  Top 0.254: IC2.17 33.26,36.52 39.45,36.52 40.32,37.39 v40.32,39.46 | v23.18,56.36 23.18,57.79 24.29,58.9 39.37,58.9 40.8,57.48 40.8,47.31 40.01,46.52 v40.01,45.89
  Bottom 0.254: CAM.10 20.95,67.63 20.95,61.13 23.18,58.9 v23.18,56.36 | v40.01,45.89 40.01,42.23 40.32,41.92 v40.32,39.46
OV7670_D3  (via drill 0.6)
  Top 0.254: v39.05,45.09 39.05,46.52 40.32,47.79 40.32,57.16 39.05,58.43 25.24,58.43 24.13,57.32 v24.13,57.16 | IC2.18 33.49,37 38.26,37 39.37,38.11 v39.37,40.25
  Bottom 0.254: CAM.11 22.23,60.81 24.13,58.9 v24.13,57.16 | v39.05,45.09 39.05,42.39 39.37,42.08 v39.37,40.25
OV7670_D4  (via drill 0.6)
  Top 0.254: IC2.33 39.85,52.03 39.85,56.84 38.73,57.95 26.04,57.95 25.08,57 v25.08,56.2
  Bottom 0.254: CAM.12 23.5,67.63 23.5,60.49 25.08,58.9 v25.08,56.2
OV7670_D5  (via drill 0.6)
  Top 0.254: v26.19,56.68 26.99,57.48 38.42,57.48 39.37,56.52 39.37,52.27 IC2.34
  Bottom 0.254: CAM.13 24.77,60.65 26.19,59.22 v26.19,56.68
OV7670_D6
  Top 0.254: CAM.14 26.04,70.18 30.32,70.18 31.43,69.06 31.43,65.89 30.16,64.62 22.07,64.62 16.83,59.38 16.83,54.54 13.97,51.68 13.97,50.49 14.53,49.93 17.02,49.93 IC2.63
OV7670_D7
  Top 0.254: CAM.15 27.3,65.73 26.67,65.1 21.75,65.1 16.35,59.7 16.35,54.78 13.49,51.92 13.49,50.33 14.37,49.46 16.79,49.46 IC2.64
OV7670_OE  (via drill 0.6)
  Top 0.254: CAM.7 17.14,64.7 14.45,62 14.45,57.79 12.54,55.89 v12.54,55.09 | v13.34,37.95 13.81,38.42 15.63,38.42 IC2.78
  Bottom 0.254: v13.34,37.95 13.81,38.42 13.81,48.27 12.7,49.38 12.7,54.94 v12.54,55.09
OV7670_RCLK  (via drill 0.6)
  Top 0.254: v20.95,70.18 19.05,70.18 18.41,69.54 18.41,63.35 15.4,60.33 15.4,55.41 12.54,52.55 12.54,50.01 14.05,48.51 16.32,48.51 IC2.66
  Bottom 0.254: CAM.16 26.04,70.18 v20.95,70.18
OV7670_RRST  (via drill 0.6)
  Top 0.254: CAM.5 14.61,64.94 13.97,64.3 13.97,58.11 11.59,55.73 v11.59,54.3 | v12.22,37.16 12.54,36.84 13.49,36.84 14.61,37.95 15.86,37.95 IC2.79
  Bottom 0.254: v12.22,37.16 12.22,38.11 13.34,39.22 13.34,48.11 12.06,49.38 12.06,53.82 v11.59,54.3
OV7670_SCL  (via drill 0.6)
  Top 0.254: IC2.92 17.59,30.49 v10.64,30.49
  Bottom 0.254: CAM.4 13.34,67.63 13.34,58.27 9.05,53.98 9.05,50.33 11.75,47.63 11.75,40.01 10.16,38.42 10.16,35.73 10.64,35.25 v10.64,30.49
OV7670_SDA  (via drill 0.6)
  Top 0.254: IC2.93 17.35,29.53 v11.59,29.53
  Bottom 0.254: CAM.6 15.88,67.63 15.88,65.89 14.61,64.62 14.61,58.74 9.53,53.66 9.53,50.49 12.38,47.63 12.38,39.85 10.64,38.11 10.64,36.04 11.59,35.09 v11.59,29.53
OV7670_WEN
  Top 0.254: CAM.18 28.57,67.63 21.75,67.63 20.95,66.84 20.95,65.1 15.88,60.02 15.88,55.09 13.02,52.24 13.02,50.17 14.21,48.98 16.55,48.98 IC2.65
OV7670_WRST  (via drill 0.6)
  Top 0.254: CAM.3 12.06,65.73 13.49,64.3 13.49,58.43 10.64,55.57 v10.64,53.19 | v12.06,35.88 13.18,35.88 14.76,37.47 16.09,37.47 IC2.80
  Bottom 0.254: v12.06,35.88 11.27,36.68 11.27,37.95 12.86,39.54 12.86,47.79 11.43,49.22 11.43,52.4 v10.64,53.19
RA_IN  (via drill 0.6)
  Top 0.254: R14.2 46.35,11.76 45.09,10.48 42.55,10.48 38.73,6.68 v36.2,6.68 35.88,6.99 35.88,10.64 38.1,12.87 42.23,12.87 42.7,13.34 42.7,18.74 36.51,24.93 34.92,24.93 31.75,28.11 31.75,29.38 v30.32,30.8
  Bottom 0.254: IC1.39 30.65,30.8 v30.32,30.8 | JK1.2 36.9,5.98 v36.2,6.68
S$1  (via drill 3)
  other vias: 52.35,78.42
SD_CS  (via drill 0.6)
  Top 0.254: IC2.51 23.81,51.62 23.81,55.25 v23.97,55.41
  Bottom 0.254: DISP.32 8.57,75.26 12.7,71.13 29.84,71.13 31.27,69.7 31.27,62.24 27.15,58.11 27.15,56.36 25.88,55.09 24.29,55.09 v23.97,55.41
SW1  (via drill 0.6)
  Top 0.254: v7.14,52.87 7.78,52.87 13.1,47.55 15.86,47.55 IC2.68
  Bottom 0.254: BUTTON4.2 3.17,56.84 v7.14,52.87
SW2  (via drill 0.6)
  Top 0.254: v7.14,51.6 8.41,51.6 12.94,47.08 15.63,47.08 IC2.69
  Bottom 0.254: BUTTON3.2 4.81,45.46 5.87,46.52 5.87,50.33 v7.14,51.6
SW4  (via drill 0.6)
  Top 0.254: v5.08,20.33 6.35,21.6 6.35,33.66 11.59,38.9 15.4,38.9 IC2.77
  Bottom 0.254: BUTTON1.2 4.81,20.06 v5.08,20.33
SWCLK  (via drill 0.6)
  Top 0.254: v5.08,33.03 11.43,39.38 15.17,39.38 IC2.76 16.44,40.65 16.99,40.65 18.26,39.38 19.05,39.38 v21.75,42.08
  Bottom 0.254: BUTTON2.2 4.81,32.76 v5.08,33.03 | ISP.3 43.18,64.78 41.91,63.51 41.91,54.94 38.26,51.28 25.72,51.28 22.38,47.95 22.38,45.41 21.75,44.77 v21.75,42.08
SWDIO  (via drill 0.6)
  Top 0.254: v22.86,44.46 19.84,44.46 18.41,43.03 17.56,43.03 IC2.72
  Bottom 0.254: v22.86,44.46 22.86,47.79 25.88,50.81 38.42,50.81 42.39,54.78 42.39,60.97 43.66,62.24 ISP.4
TFT_BL
  Top 0.61: T1.C 17.86,73.67 18.26,73.27 20,73.27 20.56,73.83 20.56,74.94 18.73,76.76 DISP.24
TFT_BL_EN  (via drill 0.6)
  Top 0.254: IC2.67 18.72,45.42 16.11,48.03 13.81,48.03 11.83,50.01 11.83,52.55 14.92,55.65 14.92,61.21 v16.51,62.79 | R19.2 17.93,71.28 15.88,69.22 v15.88,64.7
  Bottom 0.254: v16.51,62.79 16.51,63.43 15.88,64.06 v15.88,64.7
TFT_CS  (via drill 0.6)
  Top 0.254: DISP.19 22.54,78.43 22.54,76.29 27.15,71.68 31.19,71.68 33.34,69.54 33.34,65.57 30.64,62.87 22.7,62.87 18.34,58.51 18.34,53.66 16.83,52.16 v16.83,50.81 | v15.88,31.6 IC2.88
  Bottom 0.254: v16.83,50.81 16.83,49.54 16.35,49.06 16.35,32.08 v15.88,31.6
TFT_D0  (via drill 0.6)
  Top 0.254: v19.05,50.17 19.05,49.31 IC2.61
  Bottom 0.254: DISP.3 45.4,78.43 45.4,74.14 41.43,70.18 41.43,55.09 38.1,51.76 25.56,51.76 23.97,50.17 v19.05,50.17
TFT_D1  (via drill 0.6)
  Top 0.254: v18.1,51.12 18.1,49.56 IC2.62
  Bottom 0.254: DISP.4 44.13,73.67 40.96,70.49 40.96,55.41 37.78,52.24 25.4,52.24 24.29,51.12 v18.1,51.12
TFT_D2  (via drill 0.6)
  Top 0.254: IC2.81 15.05,35.73 v14.29,35.73
  Bottom 0.254: DISP.5 42.86,78.43 42.86,73.19 40.48,70.81 40.48,55.73 37.47,52.71 25.24,52.71 24.45,51.92 20.95,51.92 20.32,52.55 15.4,52.55 13.97,51.12 13.97,49.7 14.76,48.9 14.76,36.2 v14.29,35.73
TFT_D3  (via drill 0.6)
  Top 0.254: IC2.82 14.65,34.62 v13.34,34.62
  Bottom 0.254: DISP.6 41.59,72.71 40.01,71.13 40.01,56.05 37.15,53.19 25.08,53.19 24.29,52.4 21.11,52.4 20.48,53.03 15.08,53.03 13.49,51.44 13.49,49.38 14.29,48.59 14.29,37.47 13.34,36.52 v13.34,34.62
TFT_D4  (via drill 0.6)
  Top 0.254: IC2.38 38.42,54.14 v38.42,55.89
  Bottom 0.254: DISP.7 40.32,78.43 40.32,72.24 39.53,71.45 39.53,59.22 38.42,58.11 v38.42,55.89
TFT_D5  (via drill 0.6)
  Top 0.254: IC2.39 37.47,53.9 v37.47,54.94
  Bottom 0.254: DISP.8 39.05,59.54 37.47,57.95 v37.47,54.94
TFT_D6  (via drill 0.6)
  Top 0.254: IC2.40 36.35,53.49 v36.35,54.3
  Bottom 0.254: DISP.9 37.78,78.43 37.78,72.4 38.58,71.6 38.58,59.86 36.99,58.27 36.99,55.89 36.35,55.25 v36.35,54.3
TFT_D7  (via drill 0.6)
  Top 0.254: IC2.41 34.13,51.98 34.13,53.51 36.04,55.41 v36.04,56.52
  Bottom 0.254: DISP.10 36.51,72.87 38.1,71.29 38.1,60.17 36.04,58.11 v36.04,56.52
TFT_D8  (via drill 0.6)
  Top 0.254: IC2.42 33.66,52.21 33.66,53.98 35.08,55.41 v35.08,55.73
  Bottom 0.254: DISP.11 35.24,78.43 35.24,73.35 37.62,70.97 37.62,60.73 35.08,58.19 v35.08,55.73
TFT_D9  (via drill 0.6)
  Top 0.254: IC2.43 33.18,52.44 33.18,54.78 34.13,55.73 v34.13,56.52
  Bottom 0.254: DISP.12 33.97,73.91 37.15,70.73 37.15,61.13 34.13,58.11 v34.13,56.52
TFT_D10  (via drill 0.6)
  Top 0.254: IC2.44 32.7,52.67 32.7,54.94 33.02,55.25 v33.02,55.89
  Bottom 0.254: DISP.13 32.7,78.43 32.7,74.38 36.67,70.41 36.67,61.36 33.02,57.71 v33.02,55.89
TFT_D11  (via drill 0.6)
  Top 0.254: IC2.45 32.23,52.9 32.23,54.94 31.91,55.25 v31.91,56.52
  Bottom 0.254: DISP.14 31.43,74.94 36.2,70.18 36.2,61.6 31.91,57.32 v31.91,56.52
TFT_D12  (via drill 0.6)
  Top 0.254: v31.27,54.62 31.27,52.65 IC2.46
  Bottom 0.254: DISP.15 30.16,78.43 30.16,75.49 35.72,69.94 35.72,61.92 30.96,57.16 30.96,54.94 v31.27,54.62
TFT_D13
  Top 0.254: IC2.55 20.32,52.29 20.32,57.32 23.34,60.33 31.35,60.33 35.88,64.86 35.88,70.18 32.46,73.59 28.34,73.59 27.46,74.46 27.46,75.73 DISP.16
TFT_D14
  Top 0.254: IC2.56 19.84,52.06 19.84,57.63 23.18,60.97 31.19,60.97 35.24,65.02 35.24,70.02 32.15,73.11 28.1,73.11 26.99,74.22 26.99,75.89 27.62,76.52 27.62,77.48 26.35,78.75 DISP.17
TFT_D15
  Top 0.254: IC2.57 19.37,51.83 19.37,57.95 23.02,61.6 31.04,61.6 34.61,65.17 34.61,69.86 31.83,72.64 27.94,72.64 26.35,74.22 DISP.18
TFT_RD  (via drill 0.6)
  Top 0.254: v15.88,51.6 15.88,51.92 17.86,53.9 17.86,58.82 22.54,63.51 30.48,63.51 32.7,65.73 32.7,69.38 30.88,71.21 26.91,71.21 21.27,76.84 DISP.22 | v15.4,33.82 15.98,33.82 IC2.85
  Bottom 0.254: v15.88,51.6 15.88,34.3 v15.4,33.82
TFT_RS
  Top 0.254: IC2.58 18.89,51.59 18.89,58.27 22.86,62.24 30.8,62.24 33.97,65.41 33.97,69.7 31.51,72.16 27.38,72.16 23.81,75.73 DISP.20
TFT_WR  (via drill 0.6)
  Top 0.254: DISP.21 20,78.43 20,76.45 20.56,75.89 21.43,75.89 26.59,70.73 30.56,70.73 32.07,69.22 32.07,65.81 30.4,64.14 22.38,64.14 17.38,59.14 17.38,54.38 14.92,51.92 v14.92,50.81 | v14.13,31.6 14.46,31.6 IC2.86
  Bottom 0.254: v14.13,31.6 14.13,33.82 15.24,34.93 15.24,49.22 14.92,49.54 v14.92,50.81
TP_CS  (via drill 0.6)
  Top 0.254: IC2.48 29.84,52.64 29.84,54.62 28.89,55.57 v27.62,55.57
  Bottom 0.254: DISP.31 9.84,78.43 9.84,74.78 13.02,71.6 30,71.6 31.75,69.86 31.75,62.08 27.62,57.95 v27.62,55.57
TP_SD_MISO  (via drill 0.6)
  Top 0.254: IC2.53 22.23,51.8 v22.23,53.35
  Bottom 0.254: DISP.25 17.46,78.43 17.46,74.38 18.34,73.51 30.88,73.51 33.66,70.73 33.66,60.81 30.48,57.63 30.48,55.89 28.26,53.66 24.92,53.66 24.61,53.35 v22.23,53.35
TP_SD_MOSI  (via drill 0.6)
  Top 0.254: IC2.54 21.27,52.04 v21.27,54.3
  Bottom 0.254: DISP.27 14.92,78.43 14.92,75.33 17.22,73.03 30.64,73.03 33.18,70.49 33.18,60.97 30,57.79 30,56.05 28.1,54.14 24.77,54.14 24.45,53.82 23.02,53.82 22.54,54.3 v21.27,54.3
TP_SD_SCLK  (via drill 0.6)
  Top 0.254: IC2.52 23.18,51.55 23.18,54.3 v22.07,55.41
  Bottom 0.254: DISP.29 12.38,78.43 12.38,75.33 15.16,72.56 30.4,72.56 32.7,70.25 32.7,61.13 29.53,57.95 29.53,56.2 27.94,54.62 24.61,54.62 24.45,54.46 23.02,54.46 v22.07,55.41
VBAT
  Top 0.254: IC2.6 29.37,32.63 29.37,32.23 25.72,28.58 25.72,23.5 27.3,21.91 27.3,10.01 29.37,7.95 U$1.+
VCC  (via drill 0.6)
  Top 0.254: v27.3,23.5 27.3,28.9 v27.78,29.38
  Bottom 0.254: IC1.45 34.61,31.09 34.61,30.8 34.29,30.49 33.8,30.49 IC1.43 31.74,32.55 30.48,32.55 29.05,31.12 29.05,30.65 | IC1.38 30.9,29.85 29.84,29.85 29.05,30.65 | v27.78,29.38 29.05,30.65
  Bottom 0.61: L2.2 27.62,23.18 v27.3,23.5
  Bottom 0.813: L2.2 28.8,21 C19.1
VS1003_CS  (via drill 0.6)
  Top 0.254: IC2.29 35.73,45.09 v37.78,45.09 | v44.77,28.42 v42.39,28.42
  Bottom 0.254: v37.78,45.09 40.16,47.47 42.55,47.47 43.18,46.84 43.18,30.8 44.77,29.22 v44.77,28.42 | v42.39,28.42 42.39,25.41 42.86,24.93 42.86,23.5 40.96,21.6 39.15,21.6 IC1.23
VS1003_MISO  (via drill 0.6)
  Top 0.254: v36.67,46.68 35.91,46.68 IC2.31 | v45.4,23.82 45.4,24.61 v47.31,26.52
  Bottom 0.254: v47.31,26.52 46.67,27.15 46.67,29.22 44.13,31.76 44.13,47.31 43.02,48.43 39.05,48.43 38.1,47.47 37.47,47.47 v36.67,46.68 | v45.4,23.82 45.4,23.66 41.75,20.01 32.7,20.01 31.59,21.12 31.59,23.09 IC1.30
VS1003_MOSI  (via drill 0.6)
  Top 0.254: v44.45,24.77 44.45,24.93 v47.62,28.11 | v37.47,48.35 36.87,48.35 IC2.32
  Bottom 0.254: v47.62,28.11 47.62,29.06 44.61,32.08 44.61,47.63 43.34,48.9 38.73,48.9 38.18,48.35 v37.47,48.35 | v44.45,24.77 44.45,23.5 41.59,20.64 32.86,20.64 32.07,21.44 32.07,22.86 IC1.29
VS1003_SCK  (via drill 0.6)
  Top 0.254: v37.94,46.52 37.15,45.73 35.66,45.73 IC2.30 | v43.5,25.73 43.81,25.73 v45.72,27.63
  Bottom 0.254: v37.94,46.52 39.37,47.95 42.7,47.95 43.66,47 43.66,31.12 45.72,29.06 v45.72,27.63 | IC1.28 32.54,22.63 32.54,21.76 33.18,21.12 41.12,21.12 43.5,23.5 v43.5,25.73
XDCS  (via drill 0.6)
  Top 0.254: v39.37,28.27 39.37,27.79 37.78,26.2 37.15,26.2 33.34,30.01 33.34,30.8 31.59,32.55 30.16,32.55 IC2.7
  Bottom 0.254: v39.37,28.27 39.56,28.27 IC1.13